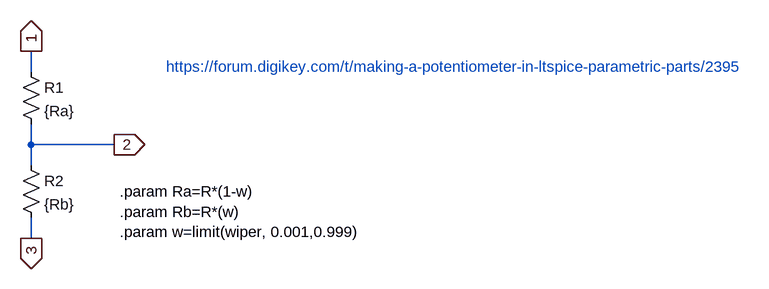
[diagram p0: schematic Pot_ckh.asc]
Pot_ckh.asc, the LTspice schematic file:
Version 4
SHEET 1 1272 680
WIRE 32 32 32 0
WIRE 32 144 32 112
WIRE 160 144 32 144
WIRE 32 176 32 144
WIRE 32 288 32 256
FLAG 32 0 1
IOPIN 32 0 Out
FLAG 160 144 2
IOPIN 160 144 Out
FLAG 32 288 3
IOPIN 32 288 Out
SYMBOL res 16 16 R0
SYMATTR InstName R1
SYMATTR Value {Ra}
SYMBOL res 16 160 R0
SYMATTR InstName R2
SYMATTR Value {Rb}
TEXT 240 24 Left 2 ;https://forum.digikey.com/t/making-a-potentiometer-in-ltspice-parametric-parts/2395
TEXT 168 216 Left 2 !.param Ra=R*(1-w)\n.param Rb=R*(w)\n.param w=limit(wiper, 0.001,0.999)

The netlist it stands for:
* Pot_ckh.asc
R1 1 2 {Ra}
R2 2 3 {Rb}
* https://forum.digikey.com/t/making-a-potentiometer-in-ltspice-parametric-parts/2395
.param Ra=R*(1-w)
.param Rb=R*(w)
.param w=limit(wiper, 0.001,0.999)
.backanno
.end